# EAGLE schematic Lync-presence-light-navigation-leds (EAGLE 8.2.2)
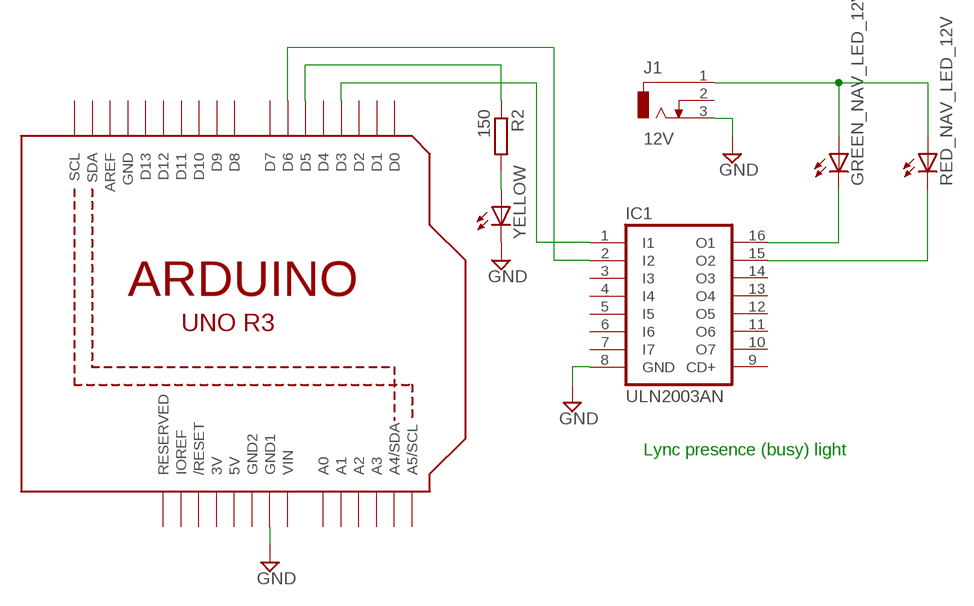
[diagram p0: schematic, sheet 1]

## Parts
GREEN_NAV_LED_12V  LED5MM  [LED5MM]
IC1  ULN2003AN  [DIL16]
J1  12V  DCJ0202  [DCJ0202]
R2  150  R0204/7  [0204/7]
RED_NAV_LED_12V  LED5MM  [LED5MM]
U1  ARDUINOR3-BPLACE  [ARDUINOR3-BPLACE]
YELLOW  LED5MM  [LED5MM]

## Nets
GND: IC1.8(GND) J1.3 U1.GND1 YELLOW.K(C)
N$1: GREEN_NAV_LED_12V.K(C) IC1.16(O1)
N$2: R2.2 YELLOW.A
N$3: IC1.15(O2) RED_NAV_LED_12V.K(C)
N$4: IC1.1(I1) U1.D3
N$5: R2.1 U1.D5
N$6: IC1.2(I2) U1.D6
N$7: GREEN_NAV_LED_12V.A J1.1 RED_NAV_LED_12V.A
Unconnected: IC1.3(I3) IC1.4(I4) IC1.5(I5) IC1.6(I6) IC1.7(I7) IC1.9(CD+) IC1.10(O7) IC1.11(O6) IC1.12(O5) IC1.13(O4) IC1.14(O3) J1.2 U1.A0 U1.A1 U1.A2 U1.A3 U1.A4(A4/SDA) U1.A5(A5/SCL) U1.AREF U1.D0 U1.D1 U1.D2 U1.D4 U1.D7 U1.D8 U1.D9 U1.D10 U1.D11 U1.D12 U1.D13 U1.IOREF U1.RESERVED U1.RESET(/RESET) U1.SCL U1.SDA

## Notes on the sheet
- Lync presence (busy) light

## Power pins joined to a net without a drawn wire
3V: U1.3V
5V: U1.5V
GND: U1.GND
GND2: U1.GND2
VIN: U1.VIN

## Library data of the parts
GREEN_NAV_LED_12V RED_NAV_LED_12V YELLOW = led:LED: LED OSRAM: - CHIPLED LG R971, LG N971, LY N971, LG Q971, LY Q971, LO R971, LY R971 LH N974, LH R974 LS Q976, LO Q976, LY Q976 LO Q996 - Hyper CHIPLED LW Q18S LB Q993, LB Q99A, LB R99A - SideLED LS A670, LO A670, LY A670, LG A670, LP A670 LB A673, LV A673, LT A673, LW A673 LH A674 LY A675 LS A676, LA A676, LO A676, LY A676, LW A676 LS A679, LY A679, LG A679 - Hyper Micro SIDELED® LS Y876, LA Y876, LO Y876, LY Y876 LT Y87S - SmartLED LW L88C, LW L88S LB L89C, LB L89S, LG L890 LS L89K, LO L89K, LY L89K LS L896, LA L896, LO L896, LY L896 - TOPLED LS T670, LO T670, LY T670, LG T670, LP T670 LSG T670, LSP T670, LSY T670, LOP T670, LYG T670 LG T671, LOG T671, LSG T671 LB T673, LV T673, LT T673, LW T673 LH T674 LS T676, LA T676, LO T676, LY T676, LB T676, LH T676, LSB T676, LW T676 LB T67C, LV T67C, LT T67C, LS T67K, LO T67K, LY T67K, LW E67C LS E67B, LA E67B, LO E67B, LY E67B, LB E67C, LV E67C, LT E67C LW T67C LS T679, LY T679, LG T679 LS T770, LO T770, LY T770, LG T770, LP T770 LB T773, LV T773, LT T773, LW T773 LH T774 LS E675, LA E675, LY E675, LS T675 LS T776, LA T776, LO T776, LY T776, LB T776 LHGB T686 LT T68C, LB T68C - Hyper Mini TOPLED® LB M676 - Mini TOPLED Santana® LG M470 LS M47K, LO M47K, LY M47K Source: http://www.osram.convergy.de LUXEON: - LUMILED® LXK2-PW12-R00, LXK2-PW12-S00, LXK2-PW14-U00, LXK2-PW14-V00 LXK2-PM12-R00, LXK2-PM12-S00, LXK2-PM14-U00 LXK2-PE12-Q00, LXK2-PE12-R00, LXK2-PE12-S00, LXK2-PE14-T00, LXK2-PE14-U00 LXK2-PB12-K00, LXK2-PB12-L00, LXK2-PB12-M00, LXK2-PB14-N00, LXK2-PB14-P00, LXK2-PB14-Q00 LXK2-PR12-L00, LXK2-PR12-M00, LXK2-PR14-Q00, LXK2-PR14-R00 LXK2-PD12-Q00, LXK2-PD12-R00, LXK2-PD12-S00 LXK2-PH12-R00, LXK2-PH12-S00 LXK2-PL12-P00, LXK2-PL12-Q00, LXK2-PL12-R00 Source: www.luxeon.com KINGBRIGHT: KA-3528ASYC Source: www.kingbright.com
IC1 = uln-udn:ULN2003A: DRIVER ARRAY
J1 = con-jack:DCJ0202: DC POWER JACK Source: DCJ0202.pdf; OC_FARNELL: unknown; OC_NEWARK: unknown
R2 = eagle-ltspice:R: RESISTOR, European symbol; SPICEMODEL: NONE; SPICEPREFIX: R
U1 = adafruit:ARDUINOR3: This is a new object for the new Arduino R3 - with extra pins that you may want to use (such as IOref, and duplicated A4/A5